# Altium project soldeerstation_2023.PrjPcb
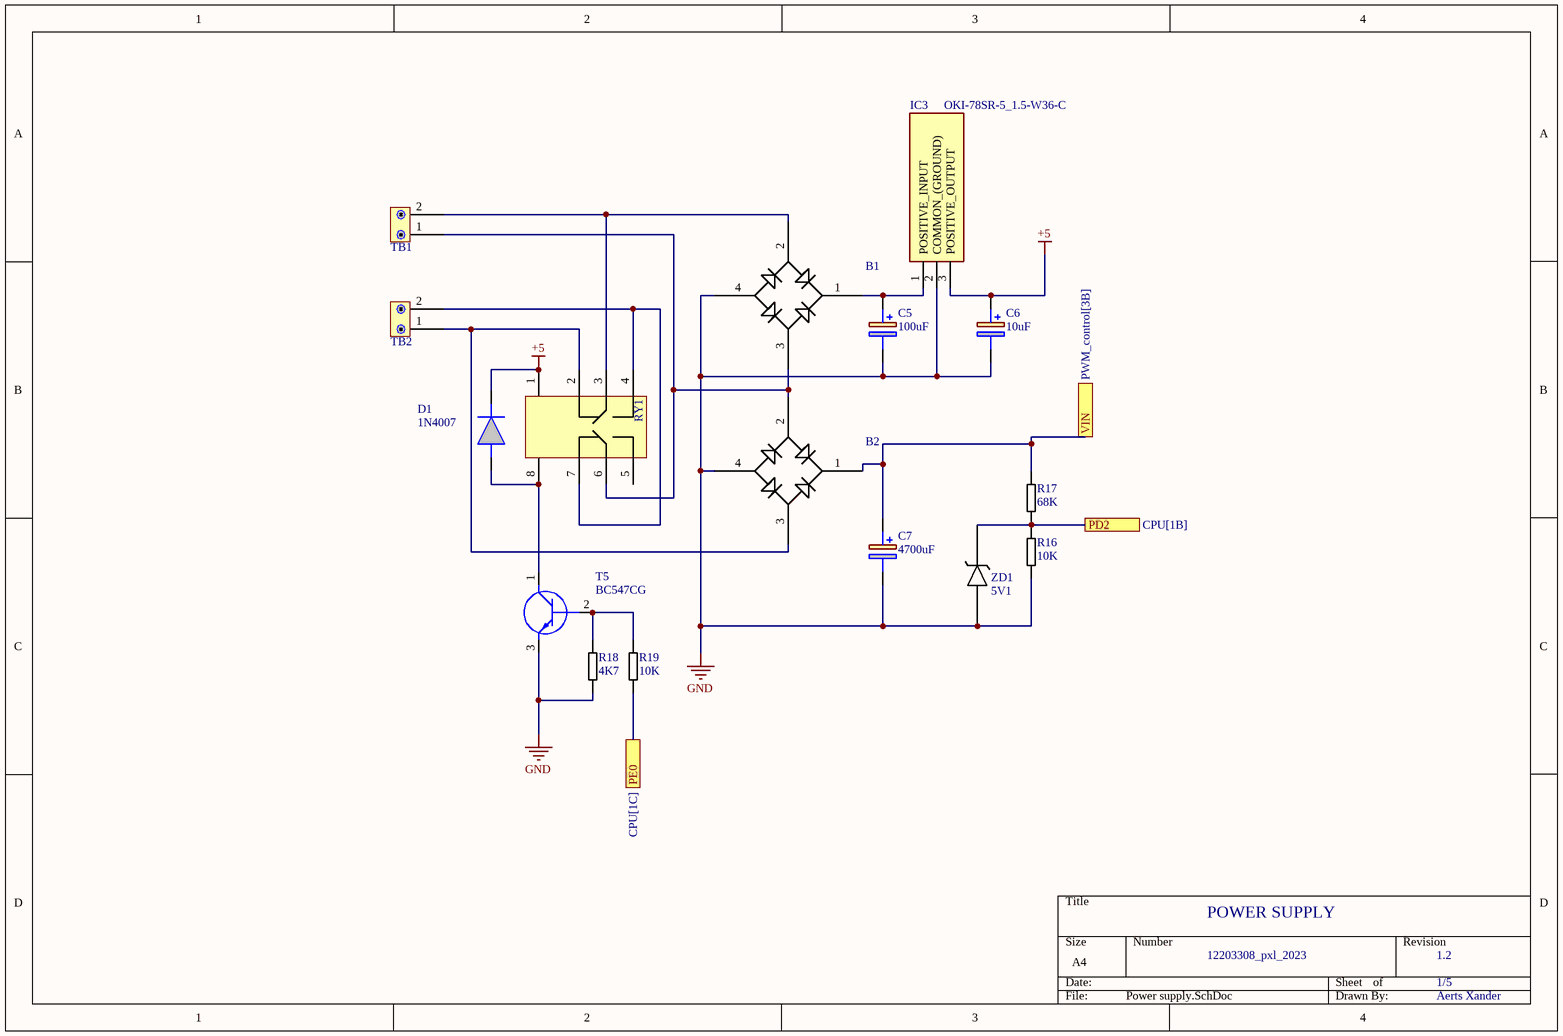
[diagram p0: Power supply.SchDoc]
version: text
2 sheets, 36 parts. Net scope: flat (ports and power ports of the same name join across sheets).
Board file: MainPCB.PcbDoc
Sheets:
  Power supply.SchDoc
  CPU.SchDoc

## Sheet Power supply.SchDoc
size A4; DrawnBy: Aerts Xander; SheetNumber: 1; SheetTotal: 5; Number: 1EAI_2023_12203308

### Parts
B1  Bruggelijkrichter  [Bruggelijkrichter]  (value not drawn)
B2  Bruggelijkrichter  [Bruggelijkrichter]  (value not drawn)
C5  100uF  [100uf tht]
C6  10uF  [10uF tht]
C7  4700uF  [4700uf tht]
D1  1N4007  [1n4007]
IC3  OKI-78SR-5_1.5-W36-C  [OKI-78SR-5_1.5-W36-C]
R16  10K  [0805]
R17  68K  [0805]
R18  4K7  [0805]
R19  10K  [0805]
RY1  RT424005  [RT424005]  (value not drawn)
T5  BC547CG  [BC547CG]
TB1  2pin screw connector  [2pin screw connector]  (value not drawn)
TB2  2pin screw connector  [2pin screw connector]  (value not drawn)
ZD1  5V1  [1n4007]

### Ports
PD2 (see CPU[1B]), PE0 (see CPU[1C]), VIN (see PWM_control[3B])

### Nets
+5: C6.1(+) D1.1(K) IC3.3(POSITIVE_OUTPUT) RY1.1(A1_COIL)
GND: B1.4 B2.4 C5.2(-) C6.2(-) C7.2(-) IC3.2(COMMON_(GROUND)) R16.1 R18.2 T5.3(E) ZD1.2
NetB1_1: B1.1 C5.1(+) IC3.1(POSITIVE_INPUT)
NetB1_2: B1.2 RY1.3(11_COM) TB1.2
NetB1_3: B1.3 B2.2 RY1.6(21_COM) TB1.1
NetB2_1: B2.1 C7.1(+) R17.2 ; port VIN
NetB2_3: B2.3 RY1.2(12_NC) TB2.1
NetD1_2: D1.2(A) RY1.8(A2_COIL) T5.1(C)
NetIC4_11: R16.2 R17.1 ZD1.1 ; port PD2
NetIC4_19: R19.2 ; port PE0
NetR18_1: R18.1 R19.1 T5.2(B)
NetRY1_4: RY1.4(14_NO) RY1.7(22_NC) TB2.2

Not connected (* = marked no-connect by the designer): RY1 5(24_NO)

### Notes on the sheet
- POWER SUPPLY
- 12203308_pxl_2023
- 1.2
- 1/5
- Aerts Xander

### Library data of the parts
C5 = 100uf tht: Aluminum Electrolytic Capacitors - Radial Leaded 50V 100uF 20%-MAL213631101E3; Manufacturer_Name: Vishay; Geometry.Height: 13.5mm; Mouser Part Number: 594-MAL213631101E3; Mouser Price/Stock: https://www.mouser.co.uk/ProductDetail/Vishay-BC-Components/MAL213631101E3?qs=aJI9t0tCUiXeynxOmA%252BOhg%3D%3D; Manufacturer_Part_Number: MAL213631101E3; Datasheet Link: https://componentsearchengine.com/Datasheets/2/MAL213631101E3.pdf
C6 = 10uF tht
C7 = 4700uf tht: Cap Aluminum Lytic 4700uF 50V 20% (18 X 40mm) Radial 7.5mm 2800mA 2000h 85C Bulk; Manufacturer_Name: Rubycon; Manufacturer_Part_Number: 50PK4700MEFC18X40; Geometry.Height: 41.5mm; Mouser Part Number: 232-50PK4700MEFC18X4; Mouser Price/Stock: https://www.mouser.co.uk/ProductDetail/Rubycon/50PK4700MEFC18X40?qs=T3oQrply3y8fu7oTpkJ7DA%3D%3D; Datasheet Link: http://www.rubycon.co.jp/en/catalog/e_pdfs/aluminum/e_pk.pdf
D1 = 1N4007: Switching diode with a peak reverse voltage of 1 kV, a maximum forward current of 1 A, and a peak repetitive forward current of 5.4 A; Manufacturer_Name: Diotec; Mouser Part Number: 637-1N4007; Mouser Price/Stock: https://www.mouser.co.uk/ProductDetail/Diotec-Semiconductor/1N4007?qs=OlC7AqGiEDmK9mU1uTiCkg%3D%3D; Manufacturer_Part_Number: 1N4007; Datasheet Link: https://diotec.com/tl_files/diotec/files/pdf/datasheets/1n4001.pdf
IC3 = OKI-78SR-5_1.5-W36-C: Power Supply; Manufacturer_Name: Murata Electronics; Manufacturer_Part_Number: OKI-78SR-5/1.5-W36-C; Datasheet Link: https://www.murata.com/products/productdata/8807037992990/oki-78sr.pdf?1583754815000; Height: 16.5mm; Mouser Part Number: 580-OKI78SR5/1.5W36C; Mouser Price/Stock: https://www.mouser.co.uk/ProductDetail/Murata-Power-Solutions/OKI-78SR-5-1.5-W36-C?qs=uJpRT2lXVNXJP%252Bo08dQqJQ%3D%3D; Arrow Part Number: OKI-78SR-5/1.5-W36-C; Arrow Price/Stock: https://www.arrow.com/en/products/oki-78sr-51.5-w36-c/murata-power-solutions?region=nac
R16-R19 = resistor: Manufacturer: Vishay Dale; Part Number: CRCW08050000Z0EA
RY1 = RT424005: Relay or Contactor; Manufacturer_Name: TE Connectivity; Datasheet Link: https://www.te.com/commerce/DocumentDelivery/DDEController?Action=showdoc&DocId=Data+Sheet%7FRT2%7F1014%7Fpdf%7FEnglish%7FENG_DS_RT2_1014.pdf%7F5-1393243-9; Manufacturer_Part_Number: RT424005; Mouser Part Number: 655-RT424005; Mouser Price/Stock: https://www.mouser.co.uk/ProductDetail/TE-Connectivity-Schrack/RT424005?qs=KKrrU%252BaSadKRsQcVuAjnsQ%3D%3D; Arrow Part Number: RT424005; Arrow Price/Stock: https://www.arrow.com/en/products/rt424005/te-connectivity?region=nac
T5 = BC547CG: Transistor BJT NPN; Manufacturer_Name: onsemi; Datasheet Link: https://www.onsemi.com/pub/Collateral/BC546-D.PDF; Height: 5.33mm; Manufacturer_Part_Number: BC547CG; Mouser Part Number: 863-BC547CG; Mouser Price/Stock: https://www.mouser.co.uk/ProductDetail/onsemi/BC547CG?qs=vLkC5FC1VN%252BHx9C8w0tCew%3D%3D; Arrow Part Number: BC547CG; Arrow Price/Stock: https://www.arrow.com/en/products/bc547cg/on-semiconductor?region=nac
ZD1 = Zener 5.1 volt

## Sheet CPU.SchDoc
size A4; SheetNumber: 2; SheetTotal: 5
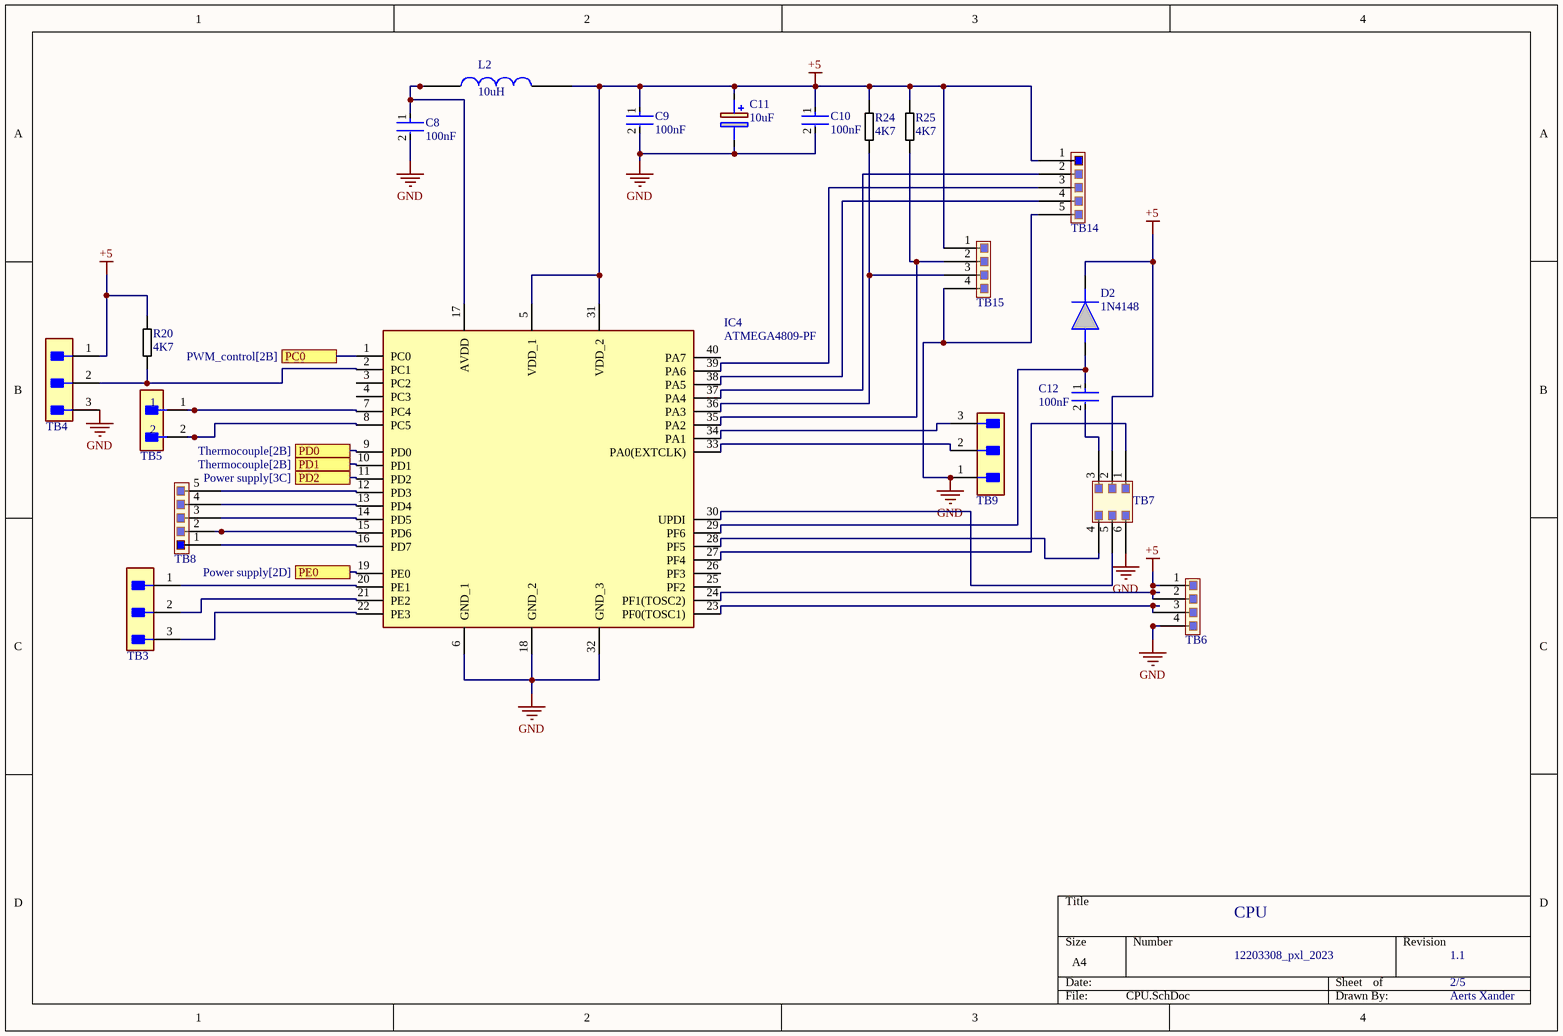
[diagram p1: CPU.SchDoc]

### Parts
C8  100nF  [0805]
C9  100nF  [0805]
C10  100nF  [0805]
C11  10uF  [10uF tht]
C12  100nF  [0805]
D2  1N4148  [1n4148]
IC4  ATMEGA4809-PF  [ATMEGA4809-PF]
L2  10uH  [10uH tht]
R20  4K7  [0805]
R24  4K7  [0805]
R25  4K7  [0805]
TB3  87224-3  [3x1 header tht]  (value not drawn)
TB4  87224-3  [3x1 header tht]  (value not drawn)
TB5  TSW-102-07-L-S  [2x1 header tht]  (value not drawn)
TB6  4x1 header tht  [4x1 header tht]  (value not drawn)
TB7  6x2 header tht  [6x2 header tht]  (value not drawn)
TB8  5x1 header tht  [5x1 header tht]  (value not drawn)
TB9  87224-3  [3x1 header tht]  (value not drawn)
TB14  5x1 header tht  [5x1 header tht]  (value not drawn)
TB15  4x1 header tht  [4x1 header tht]  (value not drawn)

### Ports
PC0 (see PWM_control[2B]), PD0 (see Thermocouple[2B]), PD1 (see Thermocouple[2B]), PD2 (see Power supply[3C]), PE0 (see Power supply[2D])

### Nets
+5: C9.1 C10.1 C11.1(+) D2.1(K) IC4.5(VDD_1) IC4.31(VDD_2) L2.2 R20.2 R24.2 R25.2 TB4.1 TB6.1 TB7.2 TB14.1 TB15.1
GND: C8.2 C9.2 C10.2 C11.2(-) IC4.6(GND_1) IC4.18(GND_2) IC4.32(GND_3) TB4.3 TB6.4 TB7.6 TB9.1 TB14.5 TB15.4
NetC8_1: C8.1 IC4.17(AVDD) L2.1
NetC12_1: C12.1 D2.2(A) IC4.29(PF6)
NetC12_2: C12.2 TB7.3
NetIC4_1: IC4.1(PC0) ; port PC0
NetIC4_2: IC4.2(PC1) R20.1 TB4.2
NetIC4_7: IC4.7(PC4) TB5.1
NetIC4_8: IC4.8(PC5) TB5.2
NetIC4_9: IC4.9(PD0) ; port PD0
NetIC4_10: IC4.10(PD1) ; port PD1
NetIC4_11: IC4.11(PD2) ; port PD2
NetIC4_12: IC4.12(PD3) TB8.5
NetIC4_13: IC4.13(PD4) TB8.4
NetIC4_14: IC4.14(PD5) TB8.3
NetIC4_15: IC4.15(PD6) TB8.2
NetIC4_16: IC4.16(PD7) TB8.1
NetIC4_19: IC4.19(PE0) ; port PE0
NetIC4_20: IC4.20(PE1) TB3.1
NetIC4_21: IC4.21(PE2) TB3.2
NetIC4_22: IC4.22(PE3) TB3.3
NetIC4_23: IC4.23(PF0(TOSC1)) TB6.3
NetIC4_24: IC4.24(PF1(TOSC2)) TB6.2
NetIC4_27: IC4.27(PF4) TB7.1
NetIC4_28: IC4.28(PF5) TB7.4
NetIC4_30: IC4.30(UPDI) TB7.5
NetIC4_33: IC4.33(PA0(EXTCLK)) TB9.2
NetIC4_34: IC4.34(PA1) TB9.3
NetIC4_35: IC4.35(PA2) R25.1 TB15.2
NetIC4_36: IC4.36(PA3) R24.1 TB15.3
NetIC4_37: IC4.37(PA4) TB14.2
NetIC4_38: IC4.38(PA5) TB14.4
NetIC4_39: IC4.39(PA6) TB14.3

Not connected (* = marked no-connect by the designer): IC4 3(PC2) 4(PC3) 25(PF2) 26(PF3) 40(PA7)

### Notes on the sheet
- CPU
- 12203308_pxl_2023
- 1.1
- 2/5
- Aerts Xander

### Library data of the parts
C8-C10 C12 = Capacitor 0805: CAP CER 10000PF 50V X7R 0603; Manufacturer Part Number: CC0603KRX7R9BB103; Manufacturer: YAGEO; Tolerance: 0.1; Material: Ceramic; Temperature Coefficient: 15%; Value: 10 nF; Mouser Description: Multilayer Ceramic Capacitor, CC Series, 0.01 - F, - 10%, X7R, 50 V, 0603 [1608 Metric]; Digikey Description: CAP CER 10000PF 50V X7R 0603; Height: 0.9mm; Category: Cap; Temperature Characteristic: X7R; Footprint Url: http://www.yageo.com/exep/pages/download/literatures/UPY-C_GEN_24.pdf; Lead Free: Yes; Voltage Rating: 50 V; Temperature: -55°C to +125°C; Device Class L3: Ceramic Capacitors; ComponentLink2Description: Datasheet; Voltage: 50 V; Package: CC0603-DA; Octopart: https://octopart.com/cc0603krx7r9bb103-yageo-192938; Automotive: No; Temperature Range High: +125°C; Temperature Range Low: -55°C; RoHS: TRUE; Device Class L1: Passive Components; ComponentLink2URL: http://www.yageo.com/documents/recent/UPY-GPHC_X7R_6.3V-to-50V_18.pdf; Device Class L2: Capacitors; Capacitance: 10 nF
C11 = 10uF tht
D2 = 1N4148: Small Signal Diode, 100V 0.3A 2-Pin DO35; Manufacturer_Name: onsemi; Mouser Part Number: 512-1N4148; Mouser Price/Stock: https://www.mouser.co.uk/ProductDetail/onsemi-Fairchild/1N4148?qs=i4Fj9T%2FoRm8RMUhj5DeFQg%3D%3D; Manufacturer_Part_Number: 1N4148; Datasheet Link: *
IC4 = ATMEGA4809-PF: Integrated Circuit; Manufacturer_Name: Microchip; Datasheet Link: http://ww1.microchip.com/downloads/en/DeviceDoc/40-pin-Data-Sheet-megaAVR-0-series-DS40002104A.pdf; Height: 6.35mm; Manufacturer_Part_Number: ATMEGA4809-PF; Mouser Part Number: 556-ATMEGA4809-PF; Mouser Price/Stock: https://www.mouser.co.uk/ProductDetail/Microchip-Technology-Atmel/ATMEGA4809-PF?qs=T3oQrply3y9UlpZbCygk%252BQ%3D%3D
L2 = 10uH tht
R20 R24 R25 = resistor: as R16 on sheet Power supply
TB3 TB4 TB9 = 3x1 header tht: CONN HEADER VERT 3POS 2.54MM; Number of Positions: 3; Gasket: No (Without); High Speed Serial Data Connector: No; Current Rating: 3A; Contact Post Length: 0.125inch; PCB Thickness: 1.397mm; PCB Mount Retention: Without; Connector Type: Plug; Approvals: CSA; PCB Mounting Orientation: Vertical; Pitch: 2.54mm; Mating Alignment: No (Without); Housing Color: Black; Contact Gender: Male; Length: 7.21mm; Max Operating Temperature: 105°C; Strain Relief: No (Without); Contact Material: Bronze; Row Spacing: 2.54mm; Series: AMPMODU MOD II; Board Standoff: No (Without); Package Quantity: 520; Radiation Hardening: No; Contact Protection: No (Without); Stabilizers: No (Without); Number of Rows: 1; Contact Mating Length: 8.08mm; Contact Shape: Square; Depth: 2.54mm; Contact Current Rating: 3A; Flammability Rating: UL94 V-0; Packaging: Carton; Number of Contacts: 3; Orientation: Straight; Mount: Through Hole; Keyed: No; Contact Type: Male Pin; Housing Material: Thermoplastic; High Temperature Housing: No; ELV: Compliant; Contact Plating: Gold; Termination: Through Hole; Selectively Loaded: No (Without); Lead Free: Lead Free; Min Operating Temperature: -65°C; Mating Connector Lock: No (Without); Color: Black; RoHS Compliant: Yes
TB5 = 2x1 header tht: CONN HEADER VERT 2POS 2.54MM; Voltage Rating: 550V; Current Rating: 7.6A; Gender: Male; Number of Contacts: 2; Connector Type: Male Pin; Radiation Hardening: No; Orientation: Straight; Contact Plating: Gold; Max Operating Temperature: 125°C; Mount: Through Hole; Package Quantity: 1; Number of Rows: 1; Housing Material: Polyester; RoHS Compliant: Yes; Length: 5.08mm; Max Voltage Rating (AC): 550V; Pitch: 2.54mm; Packaging: Bulk; Depth: 2.54mm; Termination: Solder; Min Operating Temperature: -55°C; Housing Color: Black; Lead Free: Lead Free; Color: Black; Number of Positions: 2; Width: 2.54mm; Max Current Rating: 7.6A; REACH SVHC: No SVHC; Contact Material: Bronze; Contact Mating Length: 0.23inch; Series: TSW; Contact Type: Male Pin

## Nets that join several sheets
+5: Power supply (C6.1 D1.1 IC3.3 RY1.1), CPU (15 pins)
GND: Power supply (10 pins), CPU (13 pins)
NetIC4_11: Power supply (R16.2 R17.1 ZD1.1), CPU (IC4.11)
NetIC4_19: Power supply (R19.2), CPU (IC4.19)